# EAGLE design 3-to-8 Decoder (EAGLE 7.5.0)
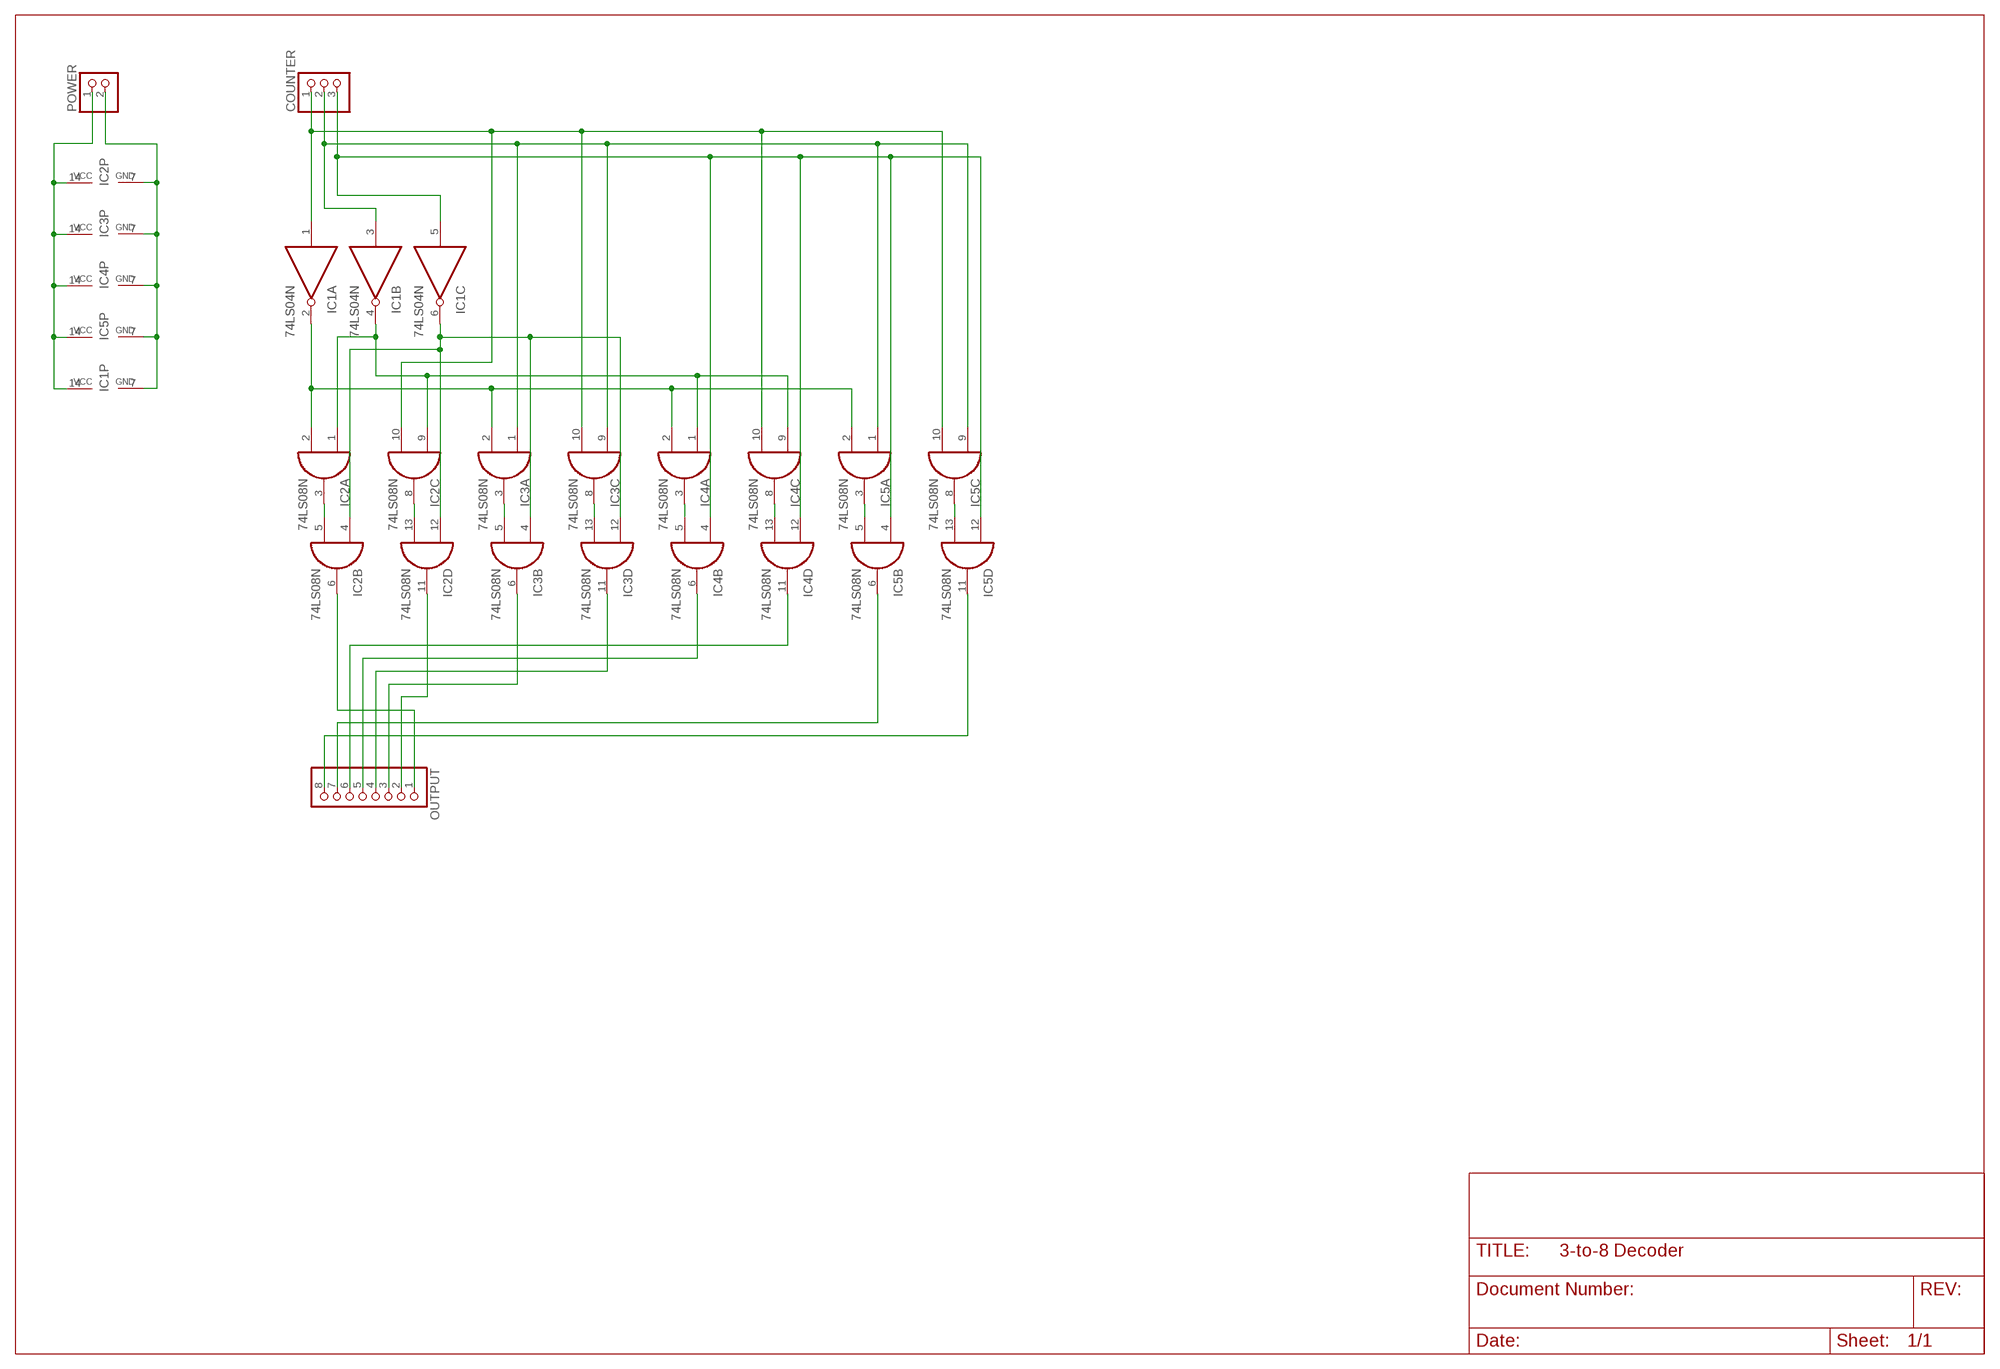
[diagram p0: schematic, sheet 1]

## Parts
COUNTER  PINHD-1X3  [1X03]
IC1  74LS04N  [DIL14]
IC2  74LS08N  [DIL14]
IC3  74LS08N  [DIL14]
IC4  74LS08N  [DIL14]
IC5  74LS08N  [DIL14]
OUTPUT  PINHD-1X8  [1X08]
POWER  PINHD-1X2  [1X02]

## Nets
GND: IC1.7(P:GND) IC2.7(P:GND) IC3.7(P:GND) IC4.7(P:GND) IC5.7(P:GND) POWER.2
N$1: COUNTER.1 IC1.1(A:I) IC2.10(C:I1) IC3.10(C:I1) IC4.10(C:I1) IC5.10(C:I1)
N$2: COUNTER.2 IC1.3(B:I) IC3.1(A:I0) IC3.9(C:I0) IC5.1(A:I0) IC5.9(C:I0)
N$3: COUNTER.3 IC1.5(C:I) IC4.4(B:I0) IC4.12(D:I0) IC5.4(B:I0) IC5.12(D:I0)
N$4: IC1.2(A:O) IC2.2(A:I1) IC3.2(A:I1) IC4.2(A:I1) IC5.2(A:I1)
N$5: IC1.4(B:O) IC2.1(A:I0) IC2.9(C:I0) IC4.1(A:I0) IC4.9(C:I0)
N$6: IC2.3(A:O) IC2.5(B:I1)
N$7: IC1.6(C:O) IC2.4(B:I0) IC2.12(D:I0) IC3.4(B:I0) IC3.12(D:I0)
N$8: IC2.11(D:O) OUTPUT.2
N$9: IC2.8(C:O) IC2.13(D:I1)
N$10: IC2.6(B:O) OUTPUT.1
N$11: IC3.3(A:O) IC3.5(B:I1)
N$12: IC3.6(B:O) OUTPUT.3
N$13: IC3.8(C:O) IC3.13(D:I1)
N$14: IC3.11(D:O) OUTPUT.4
N$15: IC4.3(A:O) IC4.5(B:I1)
N$16: IC4.6(B:O) OUTPUT.5
N$17: IC4.8(C:O) IC4.13(D:I1)
N$18: IC4.11(D:O) OUTPUT.6
N$19: IC5.3(A:O) IC5.5(B:I1)
N$20: IC5.6(B:O) OUTPUT.7
N$21: IC5.8(C:O) IC5.13(D:I1)
N$22: IC5.11(D:O) OUTPUT.8
VCC: IC1.14(P:VCC) IC2.14(P:VCC) IC3.14(P:VCC) IC4.14(P:VCC) IC5.14(P:VCC) POWER.1
Unconnected: IC1.8(D:O) IC1.9(D:I) IC1.10(E:O) IC1.11(E:I) IC1.12(F:O) IC1.13(F:I)

## Library data of the parts
COUNTER = pinhead:PINHD-1X3: PIN HEADER
IC1 = 74xx-eu:74*04: Hex INVERTER
IC2-IC5 = 74xx-eu:74*08: Quad 2-input AND gate
OUTPUT = pinhead:PINHD-1X8: PIN HEADER
POWER = pinhead:PINHD-1X2: PIN HEADER

## Board
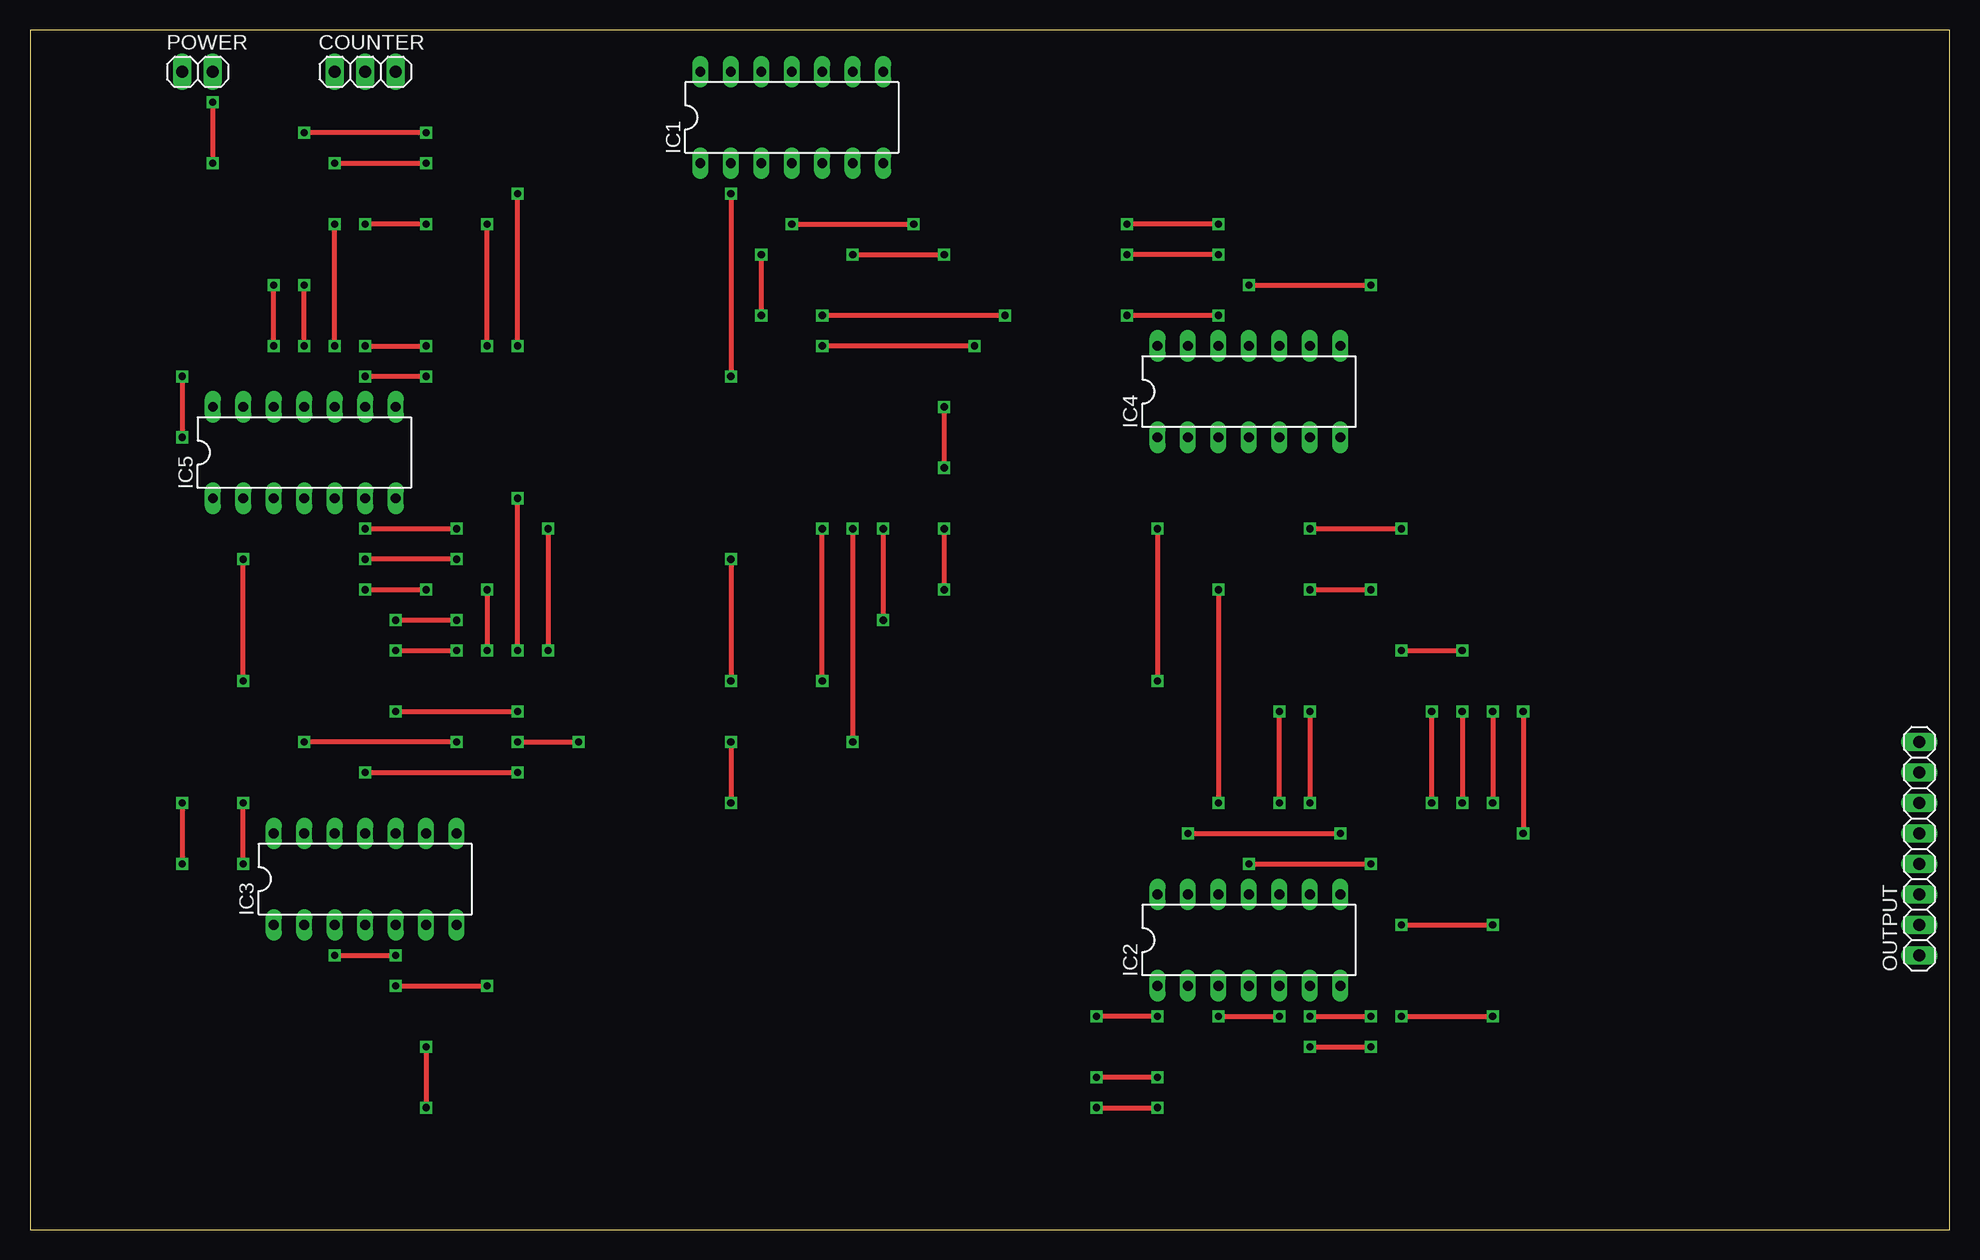
[diagram p1: board, top side]
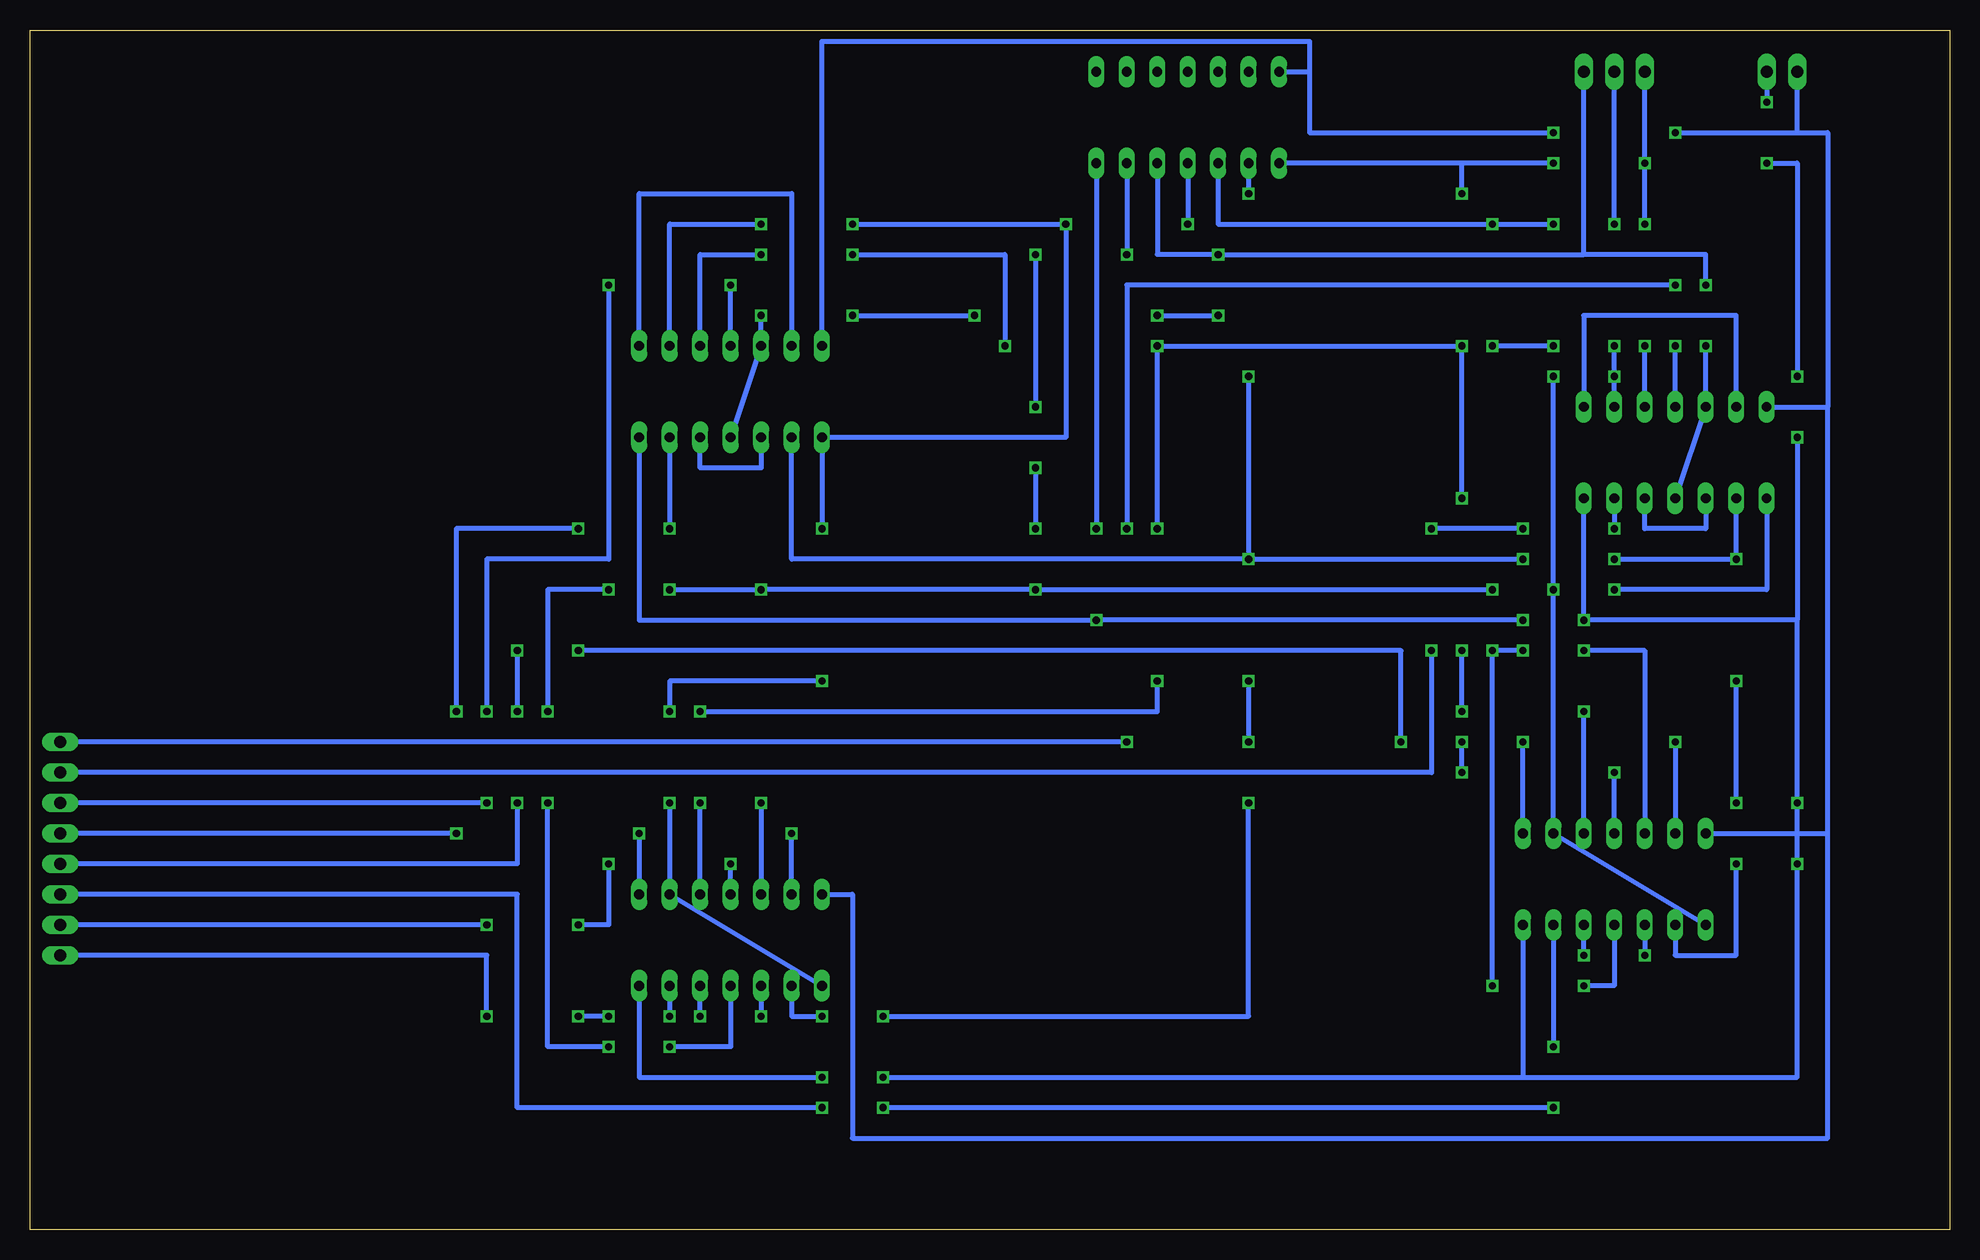
[diagram p2: board, bottom side, seen from below]

Size 160 x 100 mm. Coordinates in mm from the lower left corner, seen from the top.
Outline: 0,0 160,0 160,100 0,100 0,0
Copper layers (1*16): Top 0.035mm / dielectric 1.5mm / Bottom 0.035mm
Design rules "default": minimum track width 10mil, minimum drill 24mil, track to track 8mil, track to pad 8mil, pad to pad 8mil, via to via 8mil, smd to smd 8mil, copper to edge 40mil, drill to drill 8mil, minimum pad ring 10mil, minimum via ring 8mil, stop-mask expansion 4mil, vias tented up to drill 0mil, thermal gap 10mil

### Footprints (pad centres in the part's own frame; a part is rotated, then mirrored left to right if it is on the bottom)
1X03 = drill 1.016 long: 1 -2.54,0; 2 0,0; 3 2.54,0
DIL14 = drill 0.813 long: 1 -7.62,-3.81; 2 -5.08,-3.81; 3 -2.54,-3.81; 4 0,-3.81; 5 2.54,-3.81; 6 5.08,-3.81; 7 7.62,-3.81; 8 7.62,3.81; 9 5.08,3.81; 10 2.54,3.81; 11 0,3.81; 12 -2.54,3.81; 13 -5.08,3.81; 14 -7.62,3.81
1X08 = drill 1.016 long: 1 -8.89,0; 2 -6.35,0; 3 -3.81,0; 4 -1.27,0; 5 1.27,0; 6 3.81,0; 7 6.35,0; 8 8.89,0
1X02 = drill 1.016 long: 1 -1.27,0; 2 1.27,0

### Placement (x,y rotation side)
COUNTER  27.94,96.52 0 top
IC1  63.5,92.71 0 top
IC2  101.6,24.13 0 top
IC3  27.94,29.21 0 top
IC4  101.6,69.85 0 top
IC5  22.86,64.77 0 top
OUTPUT  157.48,31.75 90 top
POWER  13.97,96.52 0 top

### Tracks (layer width: path | path; a pad name or v marks a point on that pad's centre or on a via)
GND  (via drill 0.6)
  Top 0.406: v15.24,93.98 v15.24,88.9 | v12.7,71.12 v12.7,66.04 | v12.7,35.56 v12.7,30.48 | v93.98,12.7 v88.9,12.7 | v71.12,58.42 v71.12,50.8 | v30.48,50.8 v35.56,50.8
  Bottom 0.406: POWER.2 v15.24,93.98 | v12.7,66.04 12.7,50.8 | 12.7,50.8 v30.48,50.8 IC5.7 | IC3.7 35.56,12.7 | 35.56,12.7 12.7,12.7 v12.7,35.56 | v12.7,30.48 v12.7,35.56 | v12.7,35.56 12.7,50.8 | IC4.7 109.22,50.8 v71.12,50.8 v35.56,50.8 | IC2.7 109.22,12.7 v93.98,12.7 | v88.9,12.7 35.56,12.7 | v15.24,88.9 12.7,88.9 v12.7,71.12 | IC1.7 v71.12,58.42
N$1  (via drill 0.6)
  Top 0.406: v25.4,88.9 v33.02,88.9 | v25.4,73.66 v25.4,83.82 | v30.48,43.18 v40.64,43.18 | v40.64,48.26 v40.64,60.96 | v40.64,73.66 v40.64,86.36 | v99.06,81.28 v91.44,81.28 | v78.74,73.66 v66.04,73.66 | v104.14,35.56 v104.14,43.18 | v66.04,45.72 v66.04,58.42
  Bottom 0.406: COUNTER.1 v25.4,88.9 v25.4,83.82 | v33.02,88.9 40.64,88.9 | 40.64,88.9 IC1.1 | IC5.10 v25.4,73.66 | IC3.10 v30.48,43.18 | v40.64,43.18 v40.64,48.26 | v40.64,60.96 v40.64,73.66 v66.04,73.66 v66.04,58.42 | v40.64,86.36 40.64,88.9 | IC4.10 104.14,81.28 v99.06,81.28 | v91.44,81.28 78.74,81.28 v78.74,73.66 | IC2.10 v104.14,35.56 | v104.14,43.18 66.04,43.18 v66.04,45.72
N$2  (via drill 0.6)
  Top 0.406: v33.02,83.82 v27.94,83.82 | v27.94,73.66 v33.02,73.66 | v38.1,73.66 v38.1,83.82 | v27.94,53.34 v33.02,53.34 | v33.02,71.12 v27.94,71.12
  Bottom 0.406: IC1.3 60.96,83.82 v38.1,83.82 v33.02,83.82 | v27.94,83.82 COUNTER.2 | IC5.9 v27.94,71.12 v27.94,73.66 | v33.02,73.66 v38.1,73.66 | IC5.1 15.24,53.34 v27.94,53.34 | v33.02,71.12 v33.02,53.34 IC3.9 IC3.1
N$3  (via drill 0.6)
  Top 0.406: v20.32,73.66 v20.32,78.74 | v99.06,76.2 v91.44,76.2 | v81.28,76.2 v66.04,76.2 | v60.96,76.2 v60.96,81.28
  Bottom 0.406: IC1.5 66.04,81.28 v60.96,81.28 30.48,81.28 | 30.48,81.28 COUNTER.3 | v20.32,73.66 IC5.12 IC5.4 | v20.32,78.74 20.32,81.28 30.48,81.28 | IC4.4 IC4.12 v99.06,76.2 | v91.44,76.2 v81.28,76.2 | v66.04,76.2 v60.96,76.2
N$4  (via drill 0.6)
  Top 0.406: v58.42,86.36 v58.42,71.12 | v35.56,55.88 v27.94,55.88 | v93.98,17.78 v88.9,17.78 | v17.78,30.48 v17.78,35.56 | v17.78,45.72 v17.78,55.88 | v58.42,55.88 v58.42,45.72 | v58.42,40.64 v58.42,35.56
  Bottom 0.406: IC1.2 v58.42,86.36 | v58.42,71.12 v58.42,55.88 | v58.42,55.88 96.52,55.88 IC4.2 | v58.42,55.88 v35.56,55.88 | v27.94,55.88 v17.78,55.88 IC5.2 | IC2.2 96.52,17.78 v93.98,17.78 | v88.9,17.78 58.42,17.78 v58.42,35.56 | IC3.2 22.86,22.86 17.78,22.86 v17.78,30.48 | v17.78,35.56 v17.78,45.72 | v58.42,45.72 v58.42,40.64
N$5  (via drill 0.6)
  Top 0.406: v63.5,83.82 v73.66,83.82 | v99.06,83.82 v91.44,83.82 | v93.98,58.42 v93.98,45.72 | v106.68,43.18 v106.68,35.56
  Bottom 0.406: IC1.4 v63.5,83.82 | IC4.9 106.68,83.82 v99.06,83.82 | v91.44,83.82 v73.66,83.82 73.66,66.04 IC4.1 v93.98,58.42 | IC2.1 IC2.9 v106.68,35.56 | v93.98,45.72 106.68,45.72 v106.68,43.18
N$6  (via drill 0.6)
  Top 0.406: v99.06,17.78 v104.14,17.78
  Bottom 0.406: IC2.3 v99.06,17.78 | v104.14,17.78 IC2.5
N$7  (via drill 0.6)
  Top 0.406: v68.58,81.28 v76.2,81.28 | v76.2,68.58 v76.2,63.5 | v76.2,58.42 v76.2,53.34 | v99.06,53.34 v99.06,35.56 | v38.1,53.34 v38.1,48.26 | v30.48,20.32 v38.1,20.32 | v116.84,35.56 v116.84,43.18 | v30.48,48.26 v35.56,48.26 | v106.68,53.34 v111.76,53.34 | v106.68,15.24 v111.76,15.24
  Bottom 0.406: IC1.6 v68.58,81.28 | v76.2,81.28 v76.2,68.58 | v76.2,63.5 v76.2,58.42 | v99.06,35.56 IC2.12 | v38.1,53.34 v76.2,53.34 v99.06,53.34 v106.68,53.34 | IC3.12 25.4,48.26 v30.48,48.26 | IC3.4 27.94,20.32 v30.48,20.32 | v38.1,20.32 v38.1,48.26 v35.56,48.26 | IC2.4 101.6,15.24 v106.68,15.24 | v111.76,53.34 116.84,53.34 v116.84,43.18 | v111.76,15.24 116.84,15.24 v116.84,35.56
N$8  (via drill 0.6)
  Top 0.406: v101.6,30.48 v111.76,30.48 | v114.3,25.4 v121.92,25.4
  Bottom 0.406: IC2.11 v101.6,30.48 | v111.76,30.48 111.76,25.4 v114.3,25.4 | v121.92,25.4 OUTPUT.2
N$9  (via drill 0.6)
  Top 0.406: v96.52,33.02 v109.22,33.02
  Bottom 0.406: IC2.13 v96.52,33.02 | v109.22,33.02 IC2.8
N$10  (via drill 0.6)
  Top 0.406: v106.68,17.78 v111.76,17.78 | v114.3,17.78 v121.92,17.78
  Bottom 0.406: IC2.6 v106.68,17.78 | v121.92,17.78 121.92,22.86 OUTPUT.1 | v111.76,17.78 v114.3,17.78
N$11  (via drill 0.6)
  Top 0.406: v25.4,22.86 v30.48,22.86
  Bottom 0.406: IC3.3 v25.4,22.86 | v30.48,22.86 IC3.5
N$12  (via drill 0.6)
  Top 0.406: v33.02,15.24 v33.02,10.16 | v88.9,10.16 v93.98,10.16
  Bottom 0.406: IC3.6 v33.02,15.24 | v33.02,10.16 v88.9,10.16 | v93.98,10.16 119.38,10.16 119.38,27.94 OUTPUT.3
N$13  (via drill 0.6)
  Top 0.406: v35.56,40.64 v22.86,40.64
  Bottom 0.406: IC3.8 v35.56,40.64 | v22.86,40.64 IC3.13
N$14  (via drill 0.6)
  Top 0.406: v27.94,38.1 v40.64,38.1 | v40.64,40.64 v45.72,40.64 | v119.38,43.18 v119.38,35.56 | v114.3,48.26 v119.38,48.26
  Bottom 0.406: IC3.11 v27.94,38.1 | v40.64,38.1 v40.64,40.64 | v45.72,40.64 45.72,48.26 v114.3,48.26 | v119.38,48.26 v119.38,43.18 | v119.38,35.56 119.38,30.48 OUTPUT.4
N$15
  Bottom 0.406: IC4.3 99.06,63.5 104.14,63.5 IC4.5
N$16  (via drill 0.6)
  Top 0.406: v106.68,58.42 v114.3,58.42 | v124.46,43.18 v124.46,33.02
  Bottom 0.406: IC4.6 v106.68,58.42 | v114.3,58.42 124.46,58.42 v124.46,43.18 | v124.46,33.02 OUTPUT.5
N$17
  Bottom 0.406: IC4.8 109.22,86.36 96.52,86.36 IC4.13
N$18  (via drill 0.6)
  Top 0.406: v101.6,78.74 v111.76,78.74 | v121.92,43.18 v121.92,35.56
  Bottom 0.406: IC4.11 v101.6,78.74 | v111.76,78.74 111.76,55.88 121.92,55.88 v121.92,43.18 | v121.92,35.56 OUTPUT.6
N$19
  Bottom 0.406: IC5.3 20.32,58.42 25.4,58.42 IC5.5
N$20  (via drill 0.6)
  Top 0.406: v27.94,58.42 v35.56,58.42 | v43.18,58.42 v43.18,48.26
  Bottom 0.406: IC5.6 v27.94,58.42 | v43.18,48.26 43.18,38.1 OUTPUT.7 | v35.56,58.42 v43.18,58.42
N$21
  Bottom 0.406: IC5.13 17.78,76.2 30.48,76.2 IC5.8
N$22  (via drill 0.6)
  Top 0.406: v22.86,73.66 v22.86,78.74 | v68.58,58.42 v68.58,40.64
  Bottom 0.406: IC5.11 v22.86,73.66 | v22.86,78.74 68.58,78.74 v68.58,58.42 | v68.58,40.64 OUTPUT.8
VCC  (via drill 0.6)
  Top 0.406: v33.02,91.44 v22.86,91.44
  Bottom 0.406: IC5.14 10.16,68.58 | 12.7,91.44 POWER.1 | IC3.14 10.16,33.02 | 10.16,33.02 10.16,68.58 | IC1.14 53.34,96.52 | 53.34,96.52 53.34,91.44 v33.02,91.44 | v22.86,91.44 12.7,91.44 | IC4.14 93.98,99.06 53.34,99.06 53.34,96.52 | IC2.14 91.44,27.94 91.44,7.62 10.16,7.62 10.16,33.02 | 12.7,91.44 10.16,91.44 10.16,68.58